# Altium schematic sheet IO.SchDoc: HB+SPO2 READER | IO
size A4; DocumentNumber: 3; Revision: 1; SheetNumber: 4; SheetTotal: 4
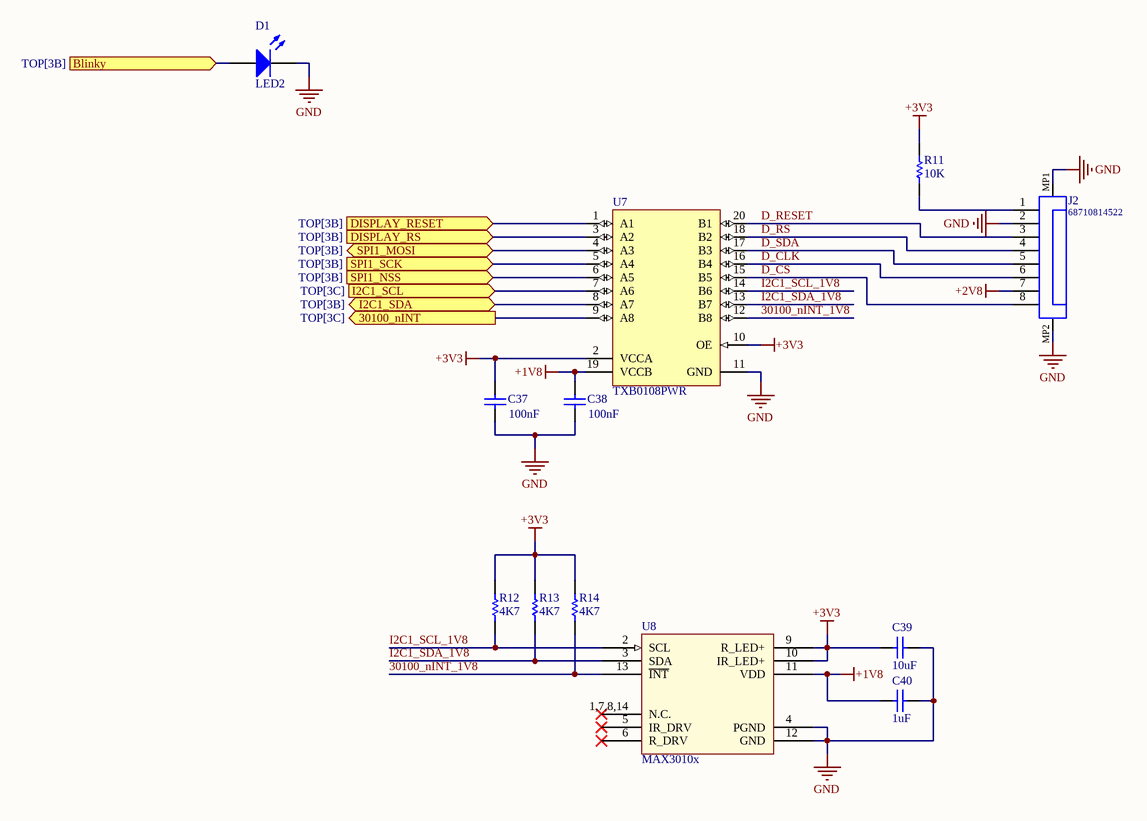
[diagram p0: IO.SchDoc]

## Parts
C37  value 100nF  [C_0603]  (hidden comment: Cap)
C38  value 100nF  [C_0603]  (hidden comment: Cap)
C39  value 10uF  [C_0603]  (hidden comment: Cap)
C40  value 1uF  [C_0603]  (hidden comment: Cap)
D1  LED2  [D-0603]
J2  68710814522  [68710814522]
R11  value 10K  [C_0603]  (hidden comment: Res1)
R12  value 4K7  [C_0603]  (hidden comment: Res1)
R13  value 4K7  [C_0603]  (hidden comment: Res1)
R14  value 4K7  [C_0603]  (hidden comment: Res1)
U7  TXB0108PWR  [PW0020A_L]
U8  MAX3010x  [OESIP14R560x330]

## Ports
30100_nINT (out, see TOP[3C]), Blinky (in, see TOP[3B]), DISPLAY_RESET (in, see TOP[3B]), DISPLAY_RS (in, see TOP[3B]), I2C1_SCL (in, see TOP[3C]), I2C1_SDA (bidir, see TOP[3B]), SPI1_MOSI (bidir, see TOP[3B]), SPI1_NSS (in, see TOP[3B]), SPI1_SCK (in, see TOP[3B])

## Nets
+1V8: C38.2 C40.2 U7.19(VCCB) U8.11(VDD)
+2V8: J2.7
+3V3: C37.2 C39.2 R11.1 R12.2 R13.2 R14.2 U7.2(VCCA) U7.10(OE) U8.9(R_LED+) U8.10(IR_LED+)
GND: C37.1 C38.1 C39.1 C40.1 D1.2(K) J2.2 J2.MP1 J2.MP2 U7.11(GND) U8.4(PGND) U8.12(GND)
30100_nINT: U7.9(A8) ; port 30100_nINT
30100_nINT_1V8: R14.1 U7.12(B8) U8.13(~{INT})
Blinky: D1.1(A) ; port Blinky
D_CLK: J2.6 U7.16(B4)
D_CS: J2.8 U7.15(B5)
D_RESET: J2.3 U7.20(B1)
D_RS: J2.4 U7.18(B2)
D_SDA: J2.5 U7.17(B3)
DISPLAY_RESET: U7.1(A1) ; port DISPLAY_RESET
DISPLAY_RS: U7.3(A2) ; port DISPLAY_RS
I2C1_SCL: U7.7(A6) ; port I2C1_SCL
I2C1_SCL_1V8: R12.1 U7.14(B6) U8.2(SCL)
I2C1_SDA: U7.8(A7) ; port I2C1_SDA
I2C1_SDA_1V8: R13.1 U7.13(B7) U8.3(SDA)
SPI1_MOSI: U7.4(A3) ; port SPI1_MOSI
SPI1_NSS: U7.6(A5) ; port SPI1_NSS
SPI1_SCK: U7.5(A4) ; port SPI1_SCK
NetJ2_1: J2.1 R11.2

Not connected (* = marked no-connect by the designer): U8 1,7,8,14(N.C.)* 5(IR_DRV)* 6(R_DRV)*

## Notes on the sheet
- Title
- Size:
- Date:
- A4
- Number:
- Time:
- Revision:
- Sheet
- of
- ShareFox
- ©
- File:

## Library data of the parts
C37-C40 = Cap: Capacitor; Published: 8-Jun-2000; LatestRevisionDate: 17-Jul-2002; LatestRevisionNote: Re-released for DXP Platform.; PackageReference: RAD-0.3; Publisher: Altium Limited; PackageDescription: Radial Cap, Thru-Hole; 2 Leads; 0.3 in Pin Spacing
D1 = LED2: Typical RED, GREEN, YELLOW, AMBER GaAs LED; Published: 8-Jun-2000; LatestRevisionDate: 17-Jul-2002; LatestRevisionNote: Re-released for DXP Platform.; PackageVersion: Feb-2002; PackageReference: 3.2X1.6X1.1; Publisher: Altium Limited; PackageDescription: SM LED; 2 Flat Leads
J2 = CMP-1502-01528-1: SMT ZIF Connectors WR-FPC, Horizontal, Bottom Contact, pitch 0.5 mm, 8 pins; Manufacturer: Wurth Elektronik; Contact Resistance: 20mOhm; Pitch: 0.5mm; Withstanding Voltage: 250VAC; Working Voltage: 50VAC; Pin Number: 8; Rated Current: 0.5A; Contact Design: BottomContact; Publisher: WurthElektronik; Orientation: Horizontal; Manufacturer URL: http://www.we-online.de; Part Number: 68710814522; Mounting Technology: SMT; Packaging: TapeandReel; Package Reference: 68710814522; Operating Temperature: -25to85degC; Datasheet URL: https://katalog.we-online.de/em/datasheet/68710814522.pdf
R11-R14 = Res1: Resistor; Published: 8-Jun-2000; LatestRevisionDate: 17-Jul-2002; LatestRevisionNote: Re-released for DXP Platform.; PackageReference: AXIAL-0.3; Publisher: Altium Limited; PackageDescription: Axial Device, Thru-Hole; 2 Leads; 0.3 in Pin Spacing
U7 = CMP-2000-07337-1: TXB0108 8-Bit Bidirectional Voltage-Level Translator with Auto-Direction Sensing and / +/- 15-kV ESD Protection, 1.2 to 3.6 V, -40 to 85 degC, 20-Pin TSSOP (PW), Green (RoHS & no Sb/Br), Tape and Reel; Manufacturer: Texas Instruments; Propagation Delay (Max): 4ns; Logic Function: Translator,Bidirectional; Input Type: Logic; Package Version: 4040064-5/G, 02/2011; Voltage - Supply: 1.2V~3.6V,1.65V~5.5V; Data Rate: 100Mbps; Other Names: 296-21527-6; Number of Channels: 8; Differential - Input: Output:No/No; Number of Outputs/Channel: 1; Product Training Modules: VoltageLevelTranslation; Dynamic Catalog: TXBSeries; Package Reference: PW20; Package Description: 20-Pin Small Outline Package Integrated Circuit, Body 6.5 x 4.4 mm, Pitch 0.65 mm; Category: IntegratedCircuits(ICs); Datasheet URL: http://www.ti.com/general/docs/lit/getliterature.tsp?genericPartNumber=TXB0108&fileType=pdf; Package / Case: 20-TSSOP(0.173",4.40mmWidth); Family: Logic-Translators; Standard Package: 1; Series: -; Manufacturer URL: http://www.ti.com/; Number of Bits: 8; Package URL: http://www.ti.com/litv/pdf/mpds362; Output Type: Logic; Datasheet Version: Rev. F, 12/2014; Packaging: Digi-Reel®; Operating Temperature: -40°C~85°C; Supplier Device Package: 20-TSSOP; Mounting Technology: SurfaceMount
U8 = MAX3010x: Pulse Oximeter and Heart-Rate Sensor IC  for Wearable Health